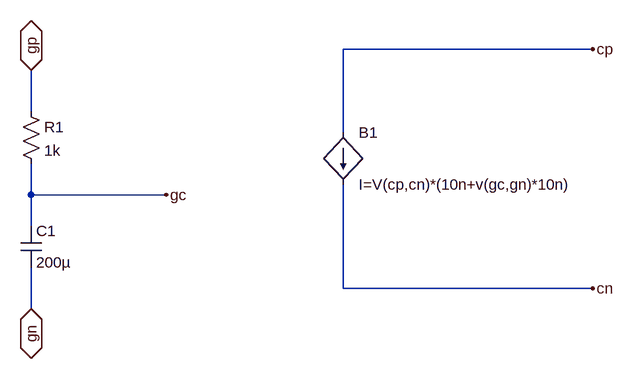
[diagram p0: schematic GP_Capteur.asc]
GP_Capteur.asc, the LTspice schematic file:
Version 4
SHEET 1 988 680
WIRE 944 32 560 32
WIRE 80 128 80 64
WIRE 560 160 560 32
WIRE 80 256 80 208
WIRE 288 256 80 256
WIRE 80 304 80 256
WIRE 560 400 560 240
WIRE 944 400 560 400
WIRE 80 432 80 368
FLAG 80 64 gp
IOPIN 80 64 BiDir
FLAG 80 432 gn
IOPIN 80 432 BiDir
FLAG 288 256 gc
FLAG 944 32 cp
FLAG 944 400 cn
SYMBOL res 64 112 R0
SYMATTR InstName R1
SYMATTR Value 1k
SYMBOL cap 64 304 R0
SYMATTR InstName C1
SYMATTR Value 200µ
SYMBOL bi 560 160 R0
SYMATTR InstName B1
SYMATTR Value I=V(cp,cn)*(10n+v(gc,gn)*10n)

The netlist it stands for:
* GP_Capteur.asc
R1 gp gc 1k
C1 gc gn 200µ
B1 cp cn I=V(cp,cn)*(10n+v(gc,gn)*10n)
.backanno
.end